# Altium schematic sheet LoRa.SchDoc: =ProjectName
size A4; CheckedBy: DatNB; Author: Ven; CompanyName: Nacentech; Organization: IMET
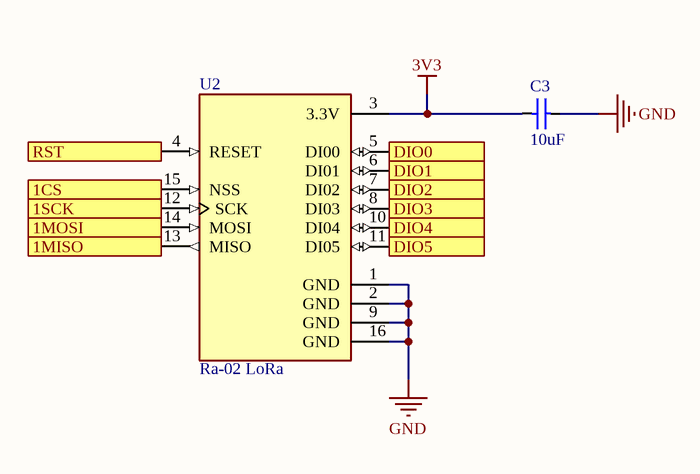
[diagram p0: LoRa.SchDoc]

## Parts
C3  10uF  [CAP_0805]
U2  Ra-02 LoRa  [Ra-02]

## Ports
1CS (in), 1MISO (out), 1MOSI (in), 1SCK (in), DIO0 (out), DIO1 (out), DIO2 (out), DIO3 (out), DIO4 (out), DIO5 (out), RST (in)

## Nets
3V3: C3.2 U2.3(3.3V)
GND: C3.1 U2.1(GND) U2.2(GND) U2.9(GND) U2.16(GND)
1CS: U2.15(NSS) ; port 1CS
1MISO: U2.13(MISO) ; port 1MISO
1MOSI: U2.14(MOSI) ; port 1MOSI
1SCK: U2.12(SCK) ; port 1SCK
DIO0: U2.5(DI00) ; port DIO0
DIO1: U2.6(DI01) ; port DIO1
DIO2: U2.7(DI02) ; port DIO2
DIO3: U2.8(DI03) ; port DIO3
DIO4: U2.10(DI04) ; port DIO4
DIO5: U2.11(DI05) ; port DIO5
RST: U2.4(RESET) ; port RST

## Notes on the sheet
- Project:
- Page Contents:
- Size:
- Date:
- A4
- Checked by:
- Time:
- Revision:
- Sheet
- of
- File:

## Library data of the parts
C3 = CapSMD: Capacitor; Value: 33p; Published: 8-Jun-2000; LatestRevisionDate: 17-Jul-2002; LatestRevisionNote: Re-released for DXP Platform.; PackageReference: RAD-0.3; Publisher: Altium Limited
U2 = Ra-02 LoRa: LoRa Module Ra-02